# EAGLE design pwr (EAGLE 9.5.2)
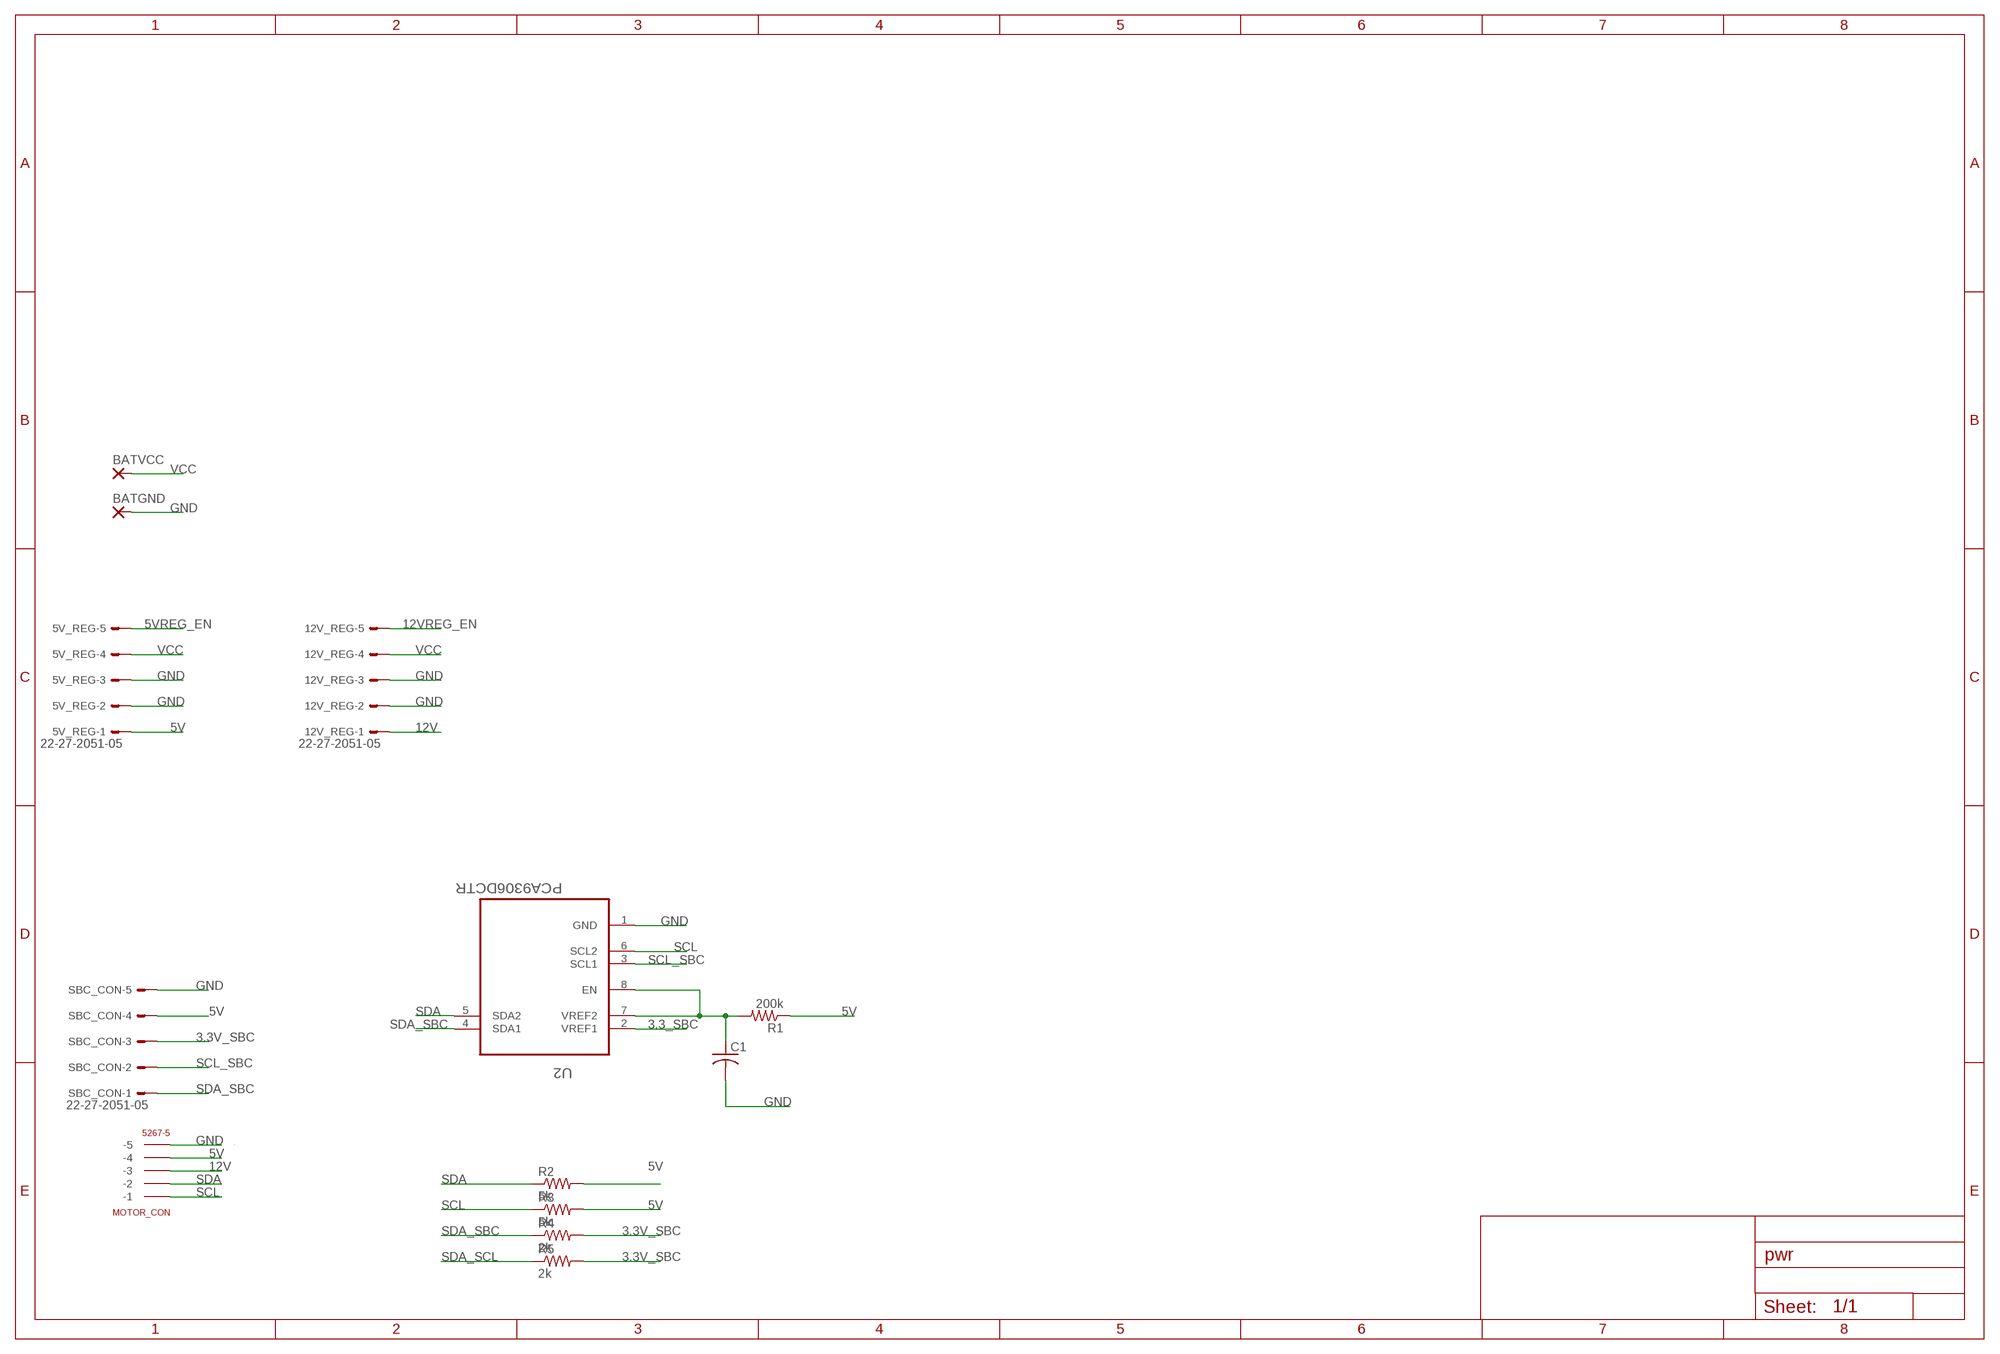
[diagram p0: schematic, sheet 1]

## Parts
5V_REG  22-27-2051-05  [6410-05]
12V_REG  22-27-2051-05  [6410-05]
BATGND  SMD5  [SMD2,54-5,08]
BATVCC  SMD5  [SMD2,54-5,08]
C1  C-USC1210  [C1210]
MOTOR_CON  5267-5  [5267-5]
R1  200k  R-US_R1210  [R1210]
R2  5k  R-US_R1210  [R1210]
R3  5k  R-US_R1210  [R1210]
R4  2k  R-US_R1210  [R1210]
R5  2k  R-US_R1210  [R1210]
SBC_CON  22-27-2051-05  [6410-05]
U2  PCA9306DCTR  [SOP65P400X130-8N]

## Nets
3.3_SBC: U2.2(VREF1)
3.3V_SBC: R4.2 R5.2 SBC_CON.3
5V [pwr]: 5V_REG.1 MOTOR_CON.P$4(-4) R1.1 R2.2 R3.2 SBC_CON.4
5VREG_EN: 5V_REG.5
12V [pwr]: 12V_REG.1 MOTOR_CON.P$3(-3)
12VREG_EN: 12V_REG.5
GND: 5V_REG.2 5V_REG.3 12V_REG.2 12V_REG.3 BATGND.1(P) C1.2 MOTOR_CON.P$5(-5) SBC_CON.5 U2.1(GND)
N$2: C1.1 R1.2 U2.7(VREF2) U2.8(EN)
SCL: MOTOR_CON.P$1(-1) R3.1 U2.6(SCL2)
SCL_SBC: SBC_CON.2 U2.3(SCL1)
SDA: MOTOR_CON.P$2(-2) R2.1 U2.5(SDA2)
SDA_SBC: R4.1 SBC_CON.1 U2.4(SDA1)
SDA_SCL: R5.1
VCC [pwr]: 5V_REG.4 12V_REG.4 BATVCC.1(P)

## Library data of the parts
5V_REG 12V_REG SBC_CON = con-molex:22-?-05: CONNECTOR wire to board 2.54 mm (.1 inch) pitch header; MF: MOLEX; OC_FARNELL: unknown; OC_NEWARK: unknown
BATGND BATVCC = wirepad:SMD5: SMD PAD
C1 = rcl:C-US: CAPACITOR, American symbol; SPICEPREFIX: C
MOTOR_CON = con-molex-spox:5267-5
R1-R5 = resistor:R-US_: RESISTOR, American symbol
U2 = PCA9306:PCA9306DCTR: VOLTAGE-LEVEL TRANSLATOR; MPN: PCA9306DCTR; OC_FARNELL: 1470936; OC_NEWARK: 65J6232; PACKAGE: SOP-8; SUPPLIER: TEXAS INSTRUMENTS

## Net classes
1 pwr: width 1.27 mm, clearance 0.254 mm

## Board
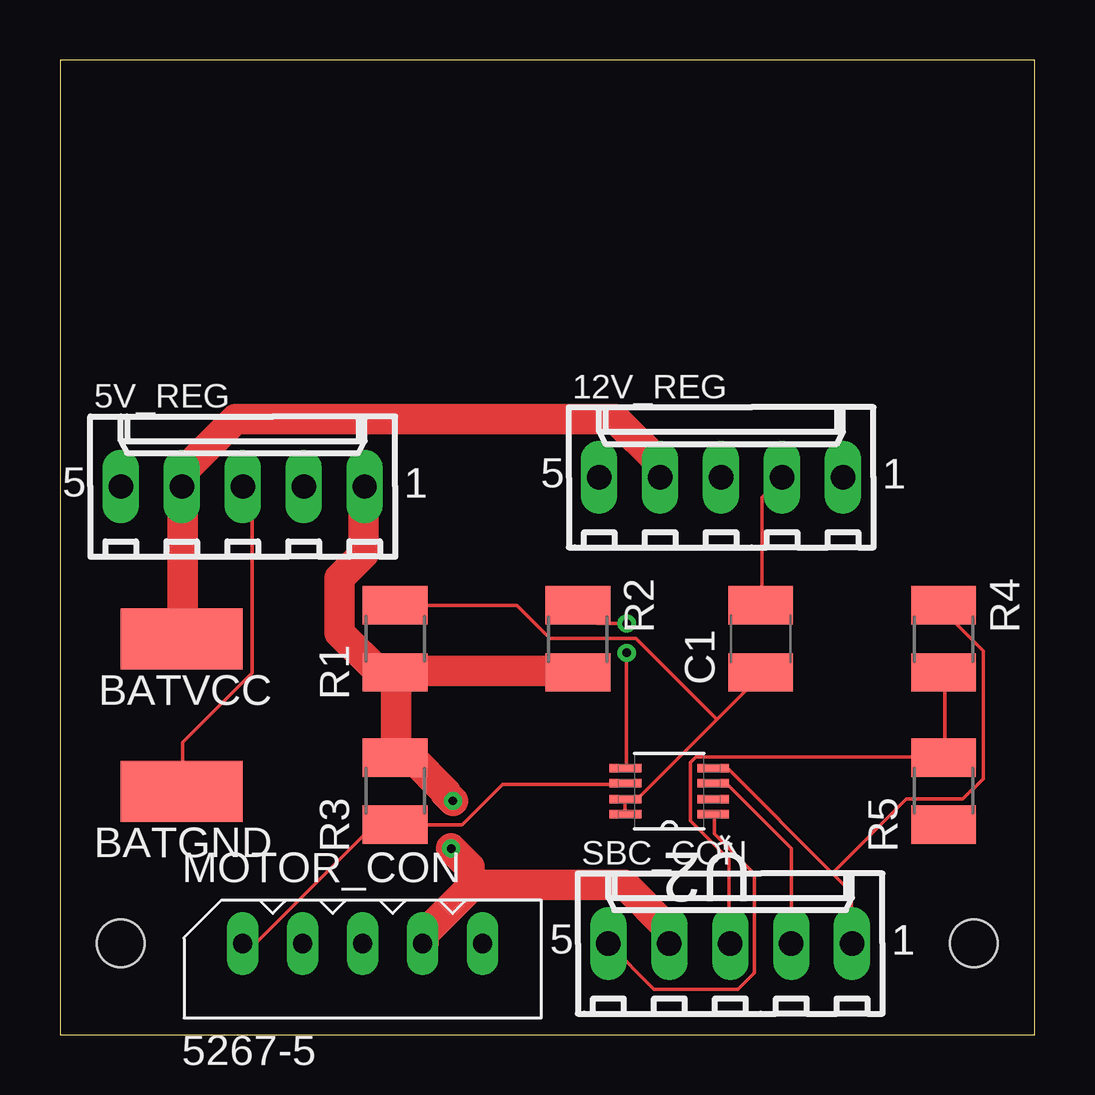
[diagram p1: board, top side]
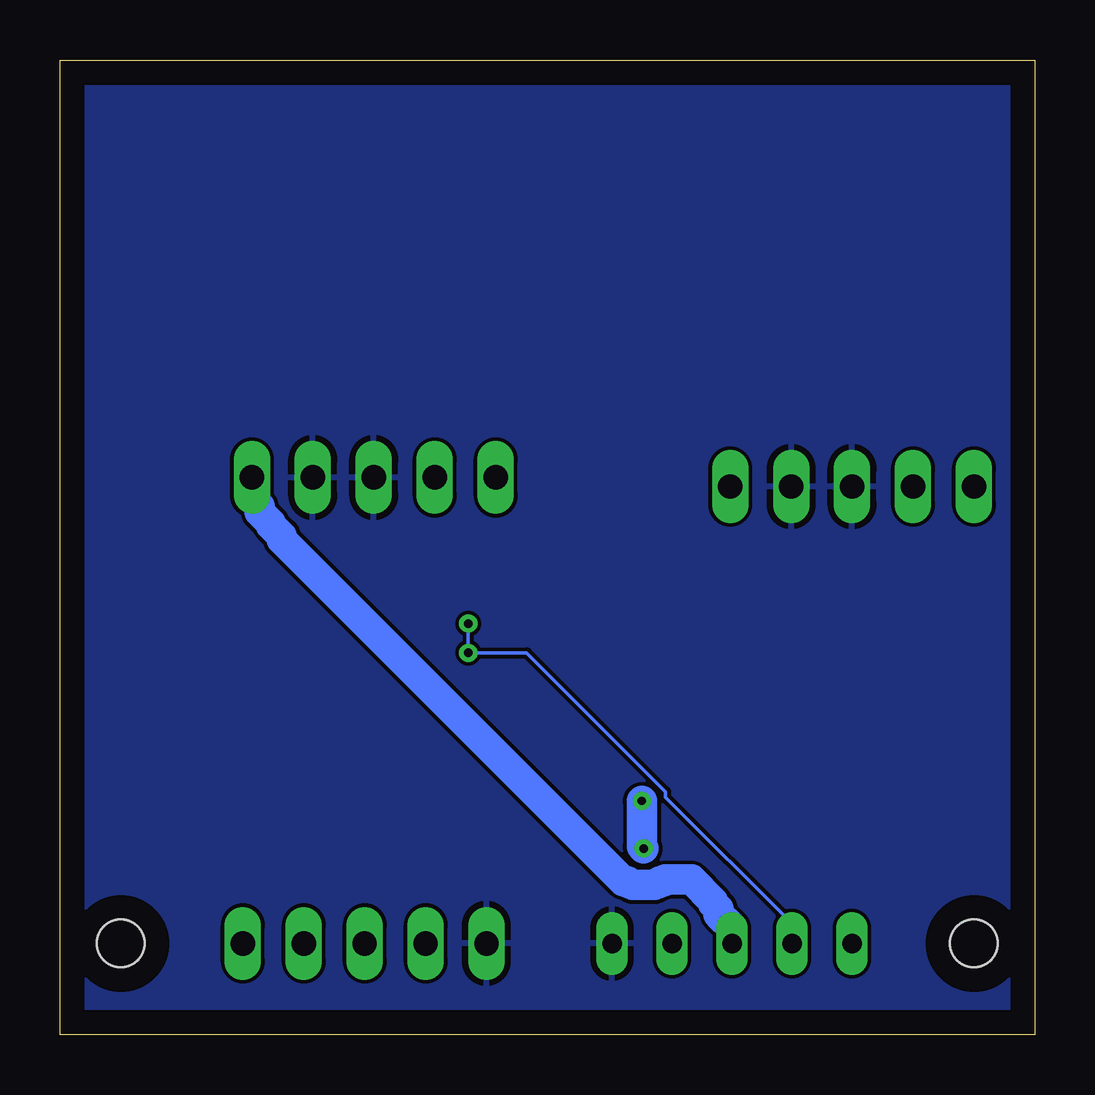
[diagram p2: board, bottom side, seen from below]

Size 40.64 x 40.64 mm. Coordinates in mm from the lower left corner, seen from the top.
Outline: 0,0 40.64,0 40.64,40.64 0,40.64 0,0
Copper layers (1*16): Top 0.035mm / dielectric 1.5mm / Bottom 0.035mm
Design rules "default": minimum track width 6mil, minimum drill 0.35mm, track to track 6mil, track to pad 6mil, pad to pad 6mil, via to via 6mil, smd to smd 6mil, copper to edge 40mil, drill to drill 6mil, minimum pad ring 10mil, minimum via ring 8mil, stop-mask expansion 4mil, vias tented up to drill 0mil, thermal gap 10mil
Holes 1.98 mm at 2.54,3.81 38.1,3.81

### Footprints (pad centres in the part's own frame; a part is rotated, then mirrored left to right if it is on the bottom)
6410-05 = drill 1.016 long: 1 5.08,0; 2 2.54,0; 3 0,0; 4 -2.54,0; 5 -5.08,0
SMD2,54-5,08 = smd 2.54 x 5.08: 1 0,0
C1210 = smd 1.6 x 2.7: 1 -1.4,0; 2 1.4,0
5267-5 = drill 0.8 long: P$1 0,0; P$2 2.5,0; P$3 5,0; P$4 7.5,0; P$5 10,0
R1210 = smd 1.6 x 2.7: 1 -1.4,0; 2 1.4,0
SOP65P400X130-8N = smd 1.321 x 0.356: 1 -1.829,0.965; 2 -1.829,0.33; 3 -1.829,-0.33; 4 -1.829,-0.965; 5 1.829,-0.965; 6 1.829,-0.33; 7 1.829,0.33; 8 1.829,0.965

### Placement (x,y rotation side)
5V_REG  7.62,22.86 0 top
12V_REG  27.56,23.24 0 top
BATGND  5.08,10.16 90 top
BATVCC  5.08,16.51 90 top
C1  29.21,16.51 90 top
MOTOR_CON  7.62,3.81 0 top
R1  13.97,16.51 90 top
R2  21.59,16.51 270 top
R3  13.97,10.16 90 top
R4  36.83,16.51 270 top
R5  36.83,10.16 90 top
SBC_CON  27.94,3.81 0 top
U2  25.4,10.16 180 top

### Tracks (layer width: path | path; a pad name or v marks a point on that pad's centre or on a via)
3.3V_SBC
  Top 0.152: R4.2 36.88,15.09 36.88,11.58 R5.2 36.8,11.58 26.52,11.58 26.29,11.35 26.29,8.91 27.89,7.32 27.89,3.81 SBC_CON.3
5V  (via drill 0.35)
  Top 1.27: 17.22,6.25 15.16,4.19 15.16,3.81 MOTOR_CON.P$4 | 17.22,6.25 23.55,6.25 25.38,4.42 25.38,3.81 SBC_CON.4 | R1.1 14.02,15.09 14.02,11.58 R3.2 14.63,11.58 16.08,10.13 16.08,10.06 v16.38,9.75 | R2.2 21.57,15.16 14.63,15.16 R1.1 | 5V_REG.1 12.65,22.86 12.65,20.04 11.66,19.05 11.66,16.76 13.34,15.09 R1.1 | v16.31,7.77 17.07,7.01 17.07,6.86 17.22,6.25
  Bottom 1.27: v16.31,7.77 16.38,7.85 v16.38,9.75
12V
  Bottom 1.27: MOTOR_CON.P$3 12.65,3.81 12.65,4.5 13.18,5.03 13.18,5.26 13.41,5.49 13.41,5.56 14.33,6.48 15.39,6.48 15.47,6.4 15.62,6.4 15.7,6.33 15.77,6.33 15.85,6.25 16.76,6.25 16.84,6.33 16.92,6.33 16.99,6.4 17.14,6.4 31.39,20.65 31.39,20.8 31.85,21.26 31.85,21.34 32.31,21.79 32.31,22.02 32.61,22.33 32.61,23.24 12V_REG.1
GND
  Top 0.152: SBC_CON.5 24.77,1.91 28.27,1.91 28.96,2.59 28.96,6.71 27.28,8.38 27.28,9.14 U2.1 | 12V_REG.2 29.26,22.4 29.26,17.98 C1.2 | 5V_REG.3 8,22.48 8,15.09 5.11,12.19 5.11,10.21 BATGND.1
  pour Bottom: -3.81,43.18 -3.81,-2.54 44.45,-2.54 44.45,44.45 -2.54,44.45
N$2
  Top 0.152: U2.8 23.55,9.22 23.55,9.83 U2.7 24.08,9.83 27.39,13.14 | 27.39,13.14 29.18,14.94 29.18,15.09 C1.1 | 27.39,13.14 24,16.54 20.42,16.54 19.05,17.91 14.02,17.91 R1.2
SCL
  Top 0.152: U2.6 23.55,10.44 18.44,10.44 16.76,8.76 14.02,8.76 R3.1 13.95,8.69 13.03,8.69 8.15,3.81 MOTOR_CON.P$1
SCL_SBC
  Top 0.152: SBC_CON.2 30.48,7.77 27.81,10.44 27.28,10.44 U2.3
SDA  (via drill 0.35)
  Top 0.152: v23.62,15.93 23.62,11.12 U2.5 | v23.62,17.14 22.4,17.14 21.64,17.91 R2.1
  Bottom 0.152: v23.62,17.14 v23.62,15.93 21.18,15.93 15.39,10.13 15.39,9.91 10.13,4.65 10.13,3.81 MOTOR_CON.P$2
SDA_SBC
  Top 0.152: U2.4 27.81,11.12 32.19,6.74 | 32.19,6.74 32.99,5.94 32.99,3.81 SBC_CON.1 | 32.19,6.74 35.28,9.83 37.64,9.83 38.48,10.67 38.48,16 36.88,17.6 36.88,17.91 R4.1
VCC
  Top 1.27: BATVCC.1 5.11,16.54 5.11,22.86 5V_REG.4 5.11,23.47 7.32,25.68 23.16,25.68 24.99,23.85 24.99,23.24 12V_REG.4